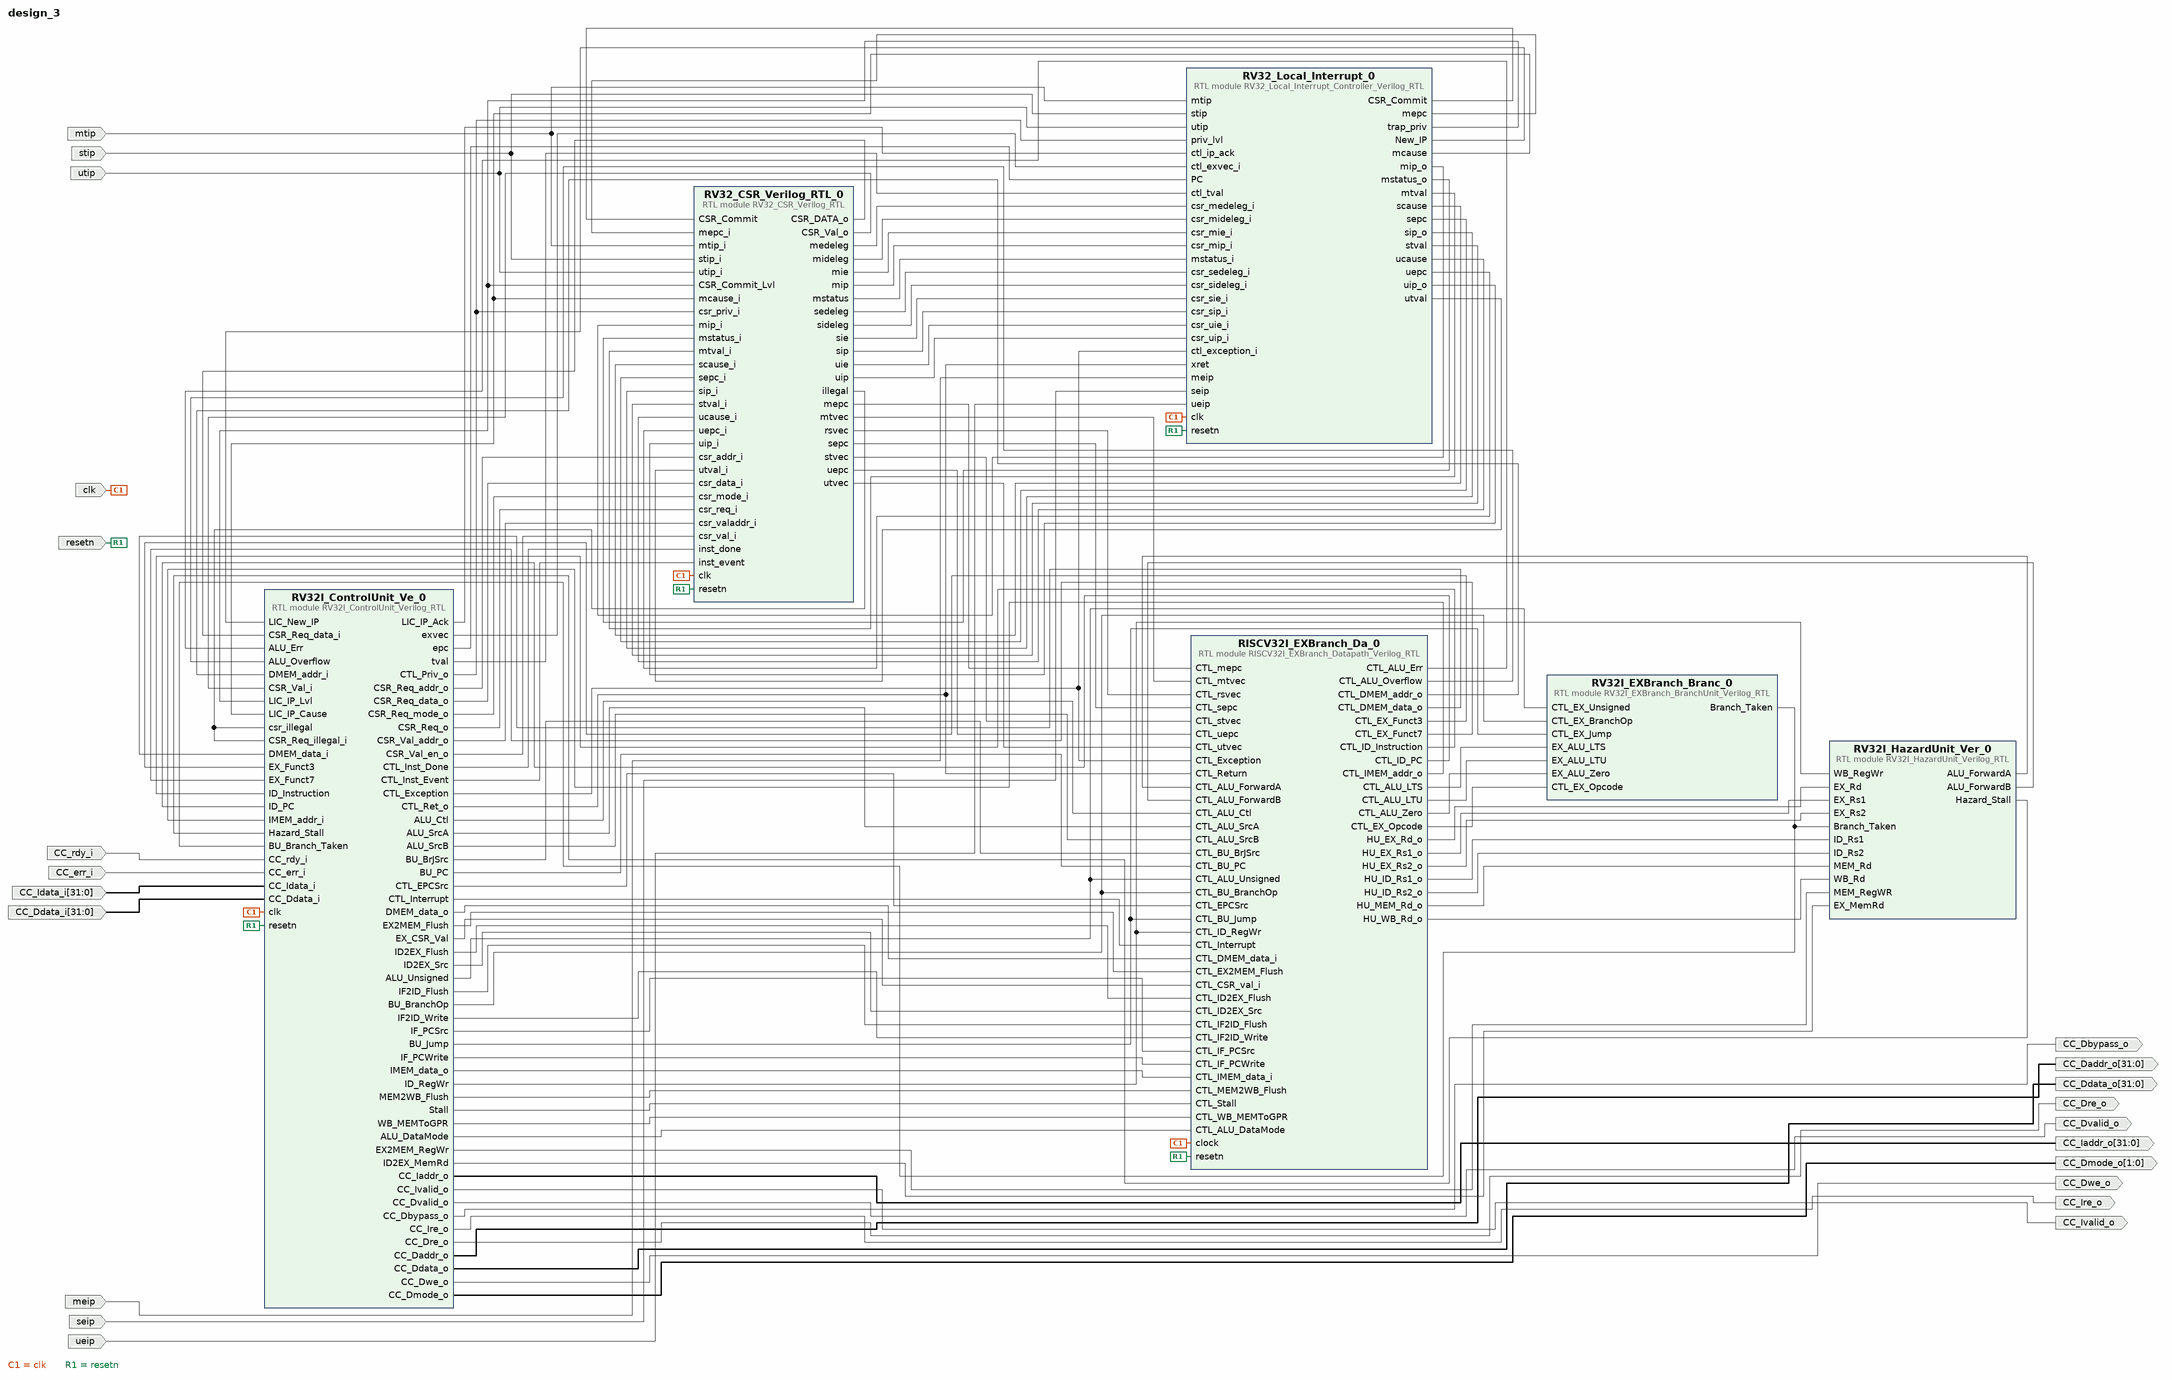
[diagram p0: block diagram of the top level]
# Vivado block design design_3, xc7z020clg484-1, Vivado 2019.2
create_bd_design design_3

create_bd_port -dir I meip
create_bd_port -dir I seip
create_bd_port -dir I ueip
create_bd_port -dir O CC_Ivalid_o
create_bd_port -dir O -from 31 -to 0 CC_Iaddr_o
create_bd_port -dir O CC_Ire_o
create_bd_port -dir O CC_Dvalid_o
create_bd_port -dir O CC_Dbypass_o
create_bd_port -dir O CC_Dre_o
create_bd_port -dir O CC_Dwe_o
create_bd_port -dir O -from 31 -to 0 CC_Daddr_o
create_bd_port -dir O -from 31 -to 0 CC_Ddata_o
create_bd_port -dir I CC_rdy_i
create_bd_port -dir I CC_err_i
create_bd_port -dir I -from 31 -to 0 CC_Idata_i
create_bd_port -dir I -from 31 -to 0 CC_Ddata_i
create_bd_port -dir I utip
create_bd_port -dir I stip
create_bd_port -dir I mtip
create_bd_port -dir I resetn
create_bd_port -dir I clk
create_bd_port -dir O -from 1 -to 0 CC_Dmode_o

create_bd_cell -type module -reference RV32I_EXBranch_BranchUnit_Verilog_RTL RV32I_EXBranch_Branc_0
create_bd_cell -type module -reference RV32I_HazardUnit_Verilog_RTL RV32I_HazardUnit_Ver_0
create_bd_cell -type module -reference RV32_Local_Interrupt_Controller_Verilog_RTL RV32_Local_Interrupt_0
create_bd_cell -type module -reference RV32_CSR_Verilog_RTL RV32_CSR_Verilog_RTL_0
create_bd_cell -type module -reference RV32I_ControlUnit_Verilog_RTL RV32I_ControlUnit_Ve_0
create_bd_cell -type module -reference RISCV32I_EXBranch_Datapath_Verilog_RTL RISCV32I_EXBranch_Da_0

# ---- connections ----

connect_bd_net [get_bd_pins RISCV32I_EXBranch_Da_0/CTL_ALU_Err] [get_bd_pins RV32I_ControlUnit_Ve_0/ALU_Err]
connect_bd_net [get_bd_pins RISCV32I_EXBranch_Da_0/CTL_ALU_LTS] [get_bd_pins RV32I_EXBranch_Branc_0/EX_ALU_LTS]
connect_bd_net [get_bd_pins RISCV32I_EXBranch_Da_0/CTL_ALU_LTU] [get_bd_pins RV32I_EXBranch_Branc_0/EX_ALU_LTU]
connect_bd_net [get_bd_pins RISCV32I_EXBranch_Da_0/CTL_ALU_Overflow] [get_bd_pins RV32I_ControlUnit_Ve_0/ALU_Overflow]
connect_bd_net [get_bd_pins RISCV32I_EXBranch_Da_0/CTL_ALU_Zero] [get_bd_pins RV32I_EXBranch_Branc_0/EX_ALU_Zero]
connect_bd_net [get_bd_pins RISCV32I_EXBranch_Da_0/CTL_DMEM_addr_o] [get_bd_pins RV32I_ControlUnit_Ve_0/DMEM_addr_i]
connect_bd_net [get_bd_pins RISCV32I_EXBranch_Da_0/CTL_DMEM_data_o] [get_bd_pins RV32I_ControlUnit_Ve_0/DMEM_data_i]
connect_bd_net [get_bd_pins RISCV32I_EXBranch_Da_0/CTL_EX_Funct3] [get_bd_pins RV32I_ControlUnit_Ve_0/EX_Funct3]
connect_bd_net [get_bd_pins RISCV32I_EXBranch_Da_0/CTL_EX_Funct7] [get_bd_pins RV32I_ControlUnit_Ve_0/EX_Funct7]
connect_bd_net [get_bd_pins RISCV32I_EXBranch_Da_0/CTL_EX_Opcode] [get_bd_pins RV32I_EXBranch_Branc_0/CTL_EX_Opcode]
connect_bd_net [get_bd_pins RISCV32I_EXBranch_Da_0/CTL_ID_Instruction] [get_bd_pins RV32I_ControlUnit_Ve_0/ID_Instruction]
connect_bd_net [get_bd_pins RISCV32I_EXBranch_Da_0/CTL_ID_PC] [get_bd_pins RV32I_ControlUnit_Ve_0/ID_PC]
connect_bd_net [get_bd_pins RISCV32I_EXBranch_Da_0/CTL_IMEM_addr_o] [get_bd_pins RV32I_ControlUnit_Ve_0/IMEM_addr_i]
connect_bd_net [get_bd_pins RISCV32I_EXBranch_Da_0/HU_EX_Rd_o] [get_bd_pins RV32I_HazardUnit_Ver_0/EX_Rd]
connect_bd_net [get_bd_pins RISCV32I_EXBranch_Da_0/HU_EX_Rs1_o] [get_bd_pins RV32I_HazardUnit_Ver_0/EX_Rs1]
connect_bd_net [get_bd_pins RISCV32I_EXBranch_Da_0/HU_EX_Rs2_o] [get_bd_pins RV32I_HazardUnit_Ver_0/EX_Rs2]
connect_bd_net [get_bd_pins RISCV32I_EXBranch_Da_0/HU_ID_Rs1_o] [get_bd_pins RV32I_HazardUnit_Ver_0/ID_Rs1]
connect_bd_net [get_bd_pins RISCV32I_EXBranch_Da_0/HU_ID_Rs2_o] [get_bd_pins RV32I_HazardUnit_Ver_0/ID_Rs2]
connect_bd_net [get_bd_pins RISCV32I_EXBranch_Da_0/HU_MEM_Rd_o] [get_bd_pins RV32I_HazardUnit_Ver_0/MEM_Rd]
connect_bd_net [get_bd_pins RV32I_ControlUnit_Ve_0/ALU_Ctl] [get_bd_pins RISCV32I_EXBranch_Da_0/CTL_ALU_Ctl]
connect_bd_net [get_bd_pins RV32I_ControlUnit_Ve_0/ALU_SrcA] [get_bd_pins RISCV32I_EXBranch_Da_0/CTL_ALU_SrcA]
connect_bd_net [get_bd_pins RV32I_ControlUnit_Ve_0/ALU_SrcB] [get_bd_pins RISCV32I_EXBranch_Da_0/CTL_ALU_SrcB]
connect_bd_net [get_bd_pins RV32I_ControlUnit_Ve_0/ALU_Unsigned] \
  [get_bd_pins RV32I_EXBranch_Branc_0/CTL_EX_Unsigned] [get_bd_pins RISCV32I_EXBranch_Da_0/CTL_ALU_Unsigned]
connect_bd_net [get_bd_pins RV32I_ControlUnit_Ve_0/BU_BrJSrc] [get_bd_pins RISCV32I_EXBranch_Da_0/CTL_BU_BrJSrc]
connect_bd_net [get_bd_pins RV32I_ControlUnit_Ve_0/BU_BranchOp] \
  [get_bd_pins RV32I_EXBranch_Branc_0/CTL_EX_BranchOp] [get_bd_pins RISCV32I_EXBranch_Da_0/CTL_BU_BranchOp]
connect_bd_net [get_bd_pins RV32I_ControlUnit_Ve_0/BU_Jump] \
  [get_bd_pins RV32I_EXBranch_Branc_0/CTL_EX_Jump] [get_bd_pins RISCV32I_EXBranch_Da_0/CTL_BU_Jump]
connect_bd_net [get_bd_pins RV32I_ControlUnit_Ve_0/BU_PC] [get_bd_pins RISCV32I_EXBranch_Da_0/CTL_BU_PC]
connect_bd_net [get_bd_pins RV32I_ControlUnit_Ve_0/CSR_Req_addr_o] [get_bd_pins RV32_CSR_Verilog_RTL_0/csr_addr_i]
connect_bd_net [get_bd_pins RV32I_ControlUnit_Ve_0/CSR_Req_data_o] [get_bd_pins RV32_CSR_Verilog_RTL_0/csr_data_i]
connect_bd_net [get_bd_pins RV32I_ControlUnit_Ve_0/CSR_Req_mode_o] [get_bd_pins RV32_CSR_Verilog_RTL_0/csr_mode_i]
connect_bd_net [get_bd_pins RV32I_ControlUnit_Ve_0/CSR_Req_o] [get_bd_pins RV32_CSR_Verilog_RTL_0/csr_req_i]
connect_bd_net [get_bd_pins RV32I_ControlUnit_Ve_0/CSR_Val_addr_o] [get_bd_pins RV32_CSR_Verilog_RTL_0/csr_valaddr_i]
connect_bd_net [get_bd_pins RV32I_ControlUnit_Ve_0/CSR_Val_en_o] [get_bd_pins RV32_CSR_Verilog_RTL_0/csr_val_i]
connect_bd_net [get_bd_pins RV32I_ControlUnit_Ve_0/CTL_EPCSrc] [get_bd_pins RISCV32I_EXBranch_Da_0/CTL_EPCSrc]
connect_bd_net [get_bd_pins RV32I_ControlUnit_Ve_0/CTL_Exception] \
  [get_bd_pins RV32_Local_Interrupt_0/ctl_exception_i] [get_bd_pins RISCV32I_EXBranch_Da_0/CTL_Exception]
connect_bd_net [get_bd_pins RV32I_ControlUnit_Ve_0/CTL_Inst_Done] [get_bd_pins RV32_CSR_Verilog_RTL_0/inst_done]
connect_bd_net [get_bd_pins RV32I_ControlUnit_Ve_0/CTL_Inst_Event] [get_bd_pins RV32_CSR_Verilog_RTL_0/inst_event]
connect_bd_net [get_bd_pins RV32I_ControlUnit_Ve_0/CTL_Interrupt] [get_bd_pins RISCV32I_EXBranch_Da_0/CTL_Interrupt]
connect_bd_net [get_bd_pins RV32I_ControlUnit_Ve_0/CTL_Priv_o] \
  [get_bd_pins RV32_Local_Interrupt_0/priv_lvl] [get_bd_pins RV32_CSR_Verilog_RTL_0/csr_priv_i]
connect_bd_net [get_bd_pins RV32I_ControlUnit_Ve_0/CTL_Ret_o] \
  [get_bd_pins RV32_Local_Interrupt_0/xret] [get_bd_pins RISCV32I_EXBranch_Da_0/CTL_Return]
connect_bd_net [get_bd_pins RV32I_ControlUnit_Ve_0/DMEM_data_o] [get_bd_pins RISCV32I_EXBranch_Da_0/CTL_DMEM_data_i]
connect_bd_net [get_bd_pins RV32I_ControlUnit_Ve_0/EX2MEM_Flush] [get_bd_pins RISCV32I_EXBranch_Da_0/CTL_EX2MEM_Flush]
connect_bd_net [get_bd_pins RV32I_ControlUnit_Ve_0/EX2MEM_RegWr] [get_bd_pins RV32I_HazardUnit_Ver_0/MEM_RegWR]
connect_bd_net [get_bd_pins RV32I_ControlUnit_Ve_0/EX_CSR_Val] [get_bd_pins RISCV32I_EXBranch_Da_0/CTL_CSR_val_i]
connect_bd_net [get_bd_pins RV32I_ControlUnit_Ve_0/ID2EX_Flush] [get_bd_pins RISCV32I_EXBranch_Da_0/CTL_ID2EX_Flush]
connect_bd_net [get_bd_pins RV32I_ControlUnit_Ve_0/ID2EX_MemRd] [get_bd_pins RV32I_HazardUnit_Ver_0/EX_MemRd]
connect_bd_net [get_bd_pins RV32I_ControlUnit_Ve_0/ID2EX_Src] [get_bd_pins RISCV32I_EXBranch_Da_0/CTL_ID2EX_Src]
connect_bd_net [get_bd_pins RV32I_ControlUnit_Ve_0/ID_RegWr] \
  [get_bd_pins RV32I_HazardUnit_Ver_0/WB_RegWr] [get_bd_pins RISCV32I_EXBranch_Da_0/CTL_ID_RegWr]
connect_bd_net [get_bd_pins RV32I_ControlUnit_Ve_0/IF2ID_Flush] [get_bd_pins RISCV32I_EXBranch_Da_0/CTL_IF2ID_Flush]
connect_bd_net [get_bd_pins RV32I_ControlUnit_Ve_0/IF2ID_Write] [get_bd_pins RISCV32I_EXBranch_Da_0/CTL_IF2ID_Write]
connect_bd_net [get_bd_pins RV32I_ControlUnit_Ve_0/IF_PCSrc] [get_bd_pins RISCV32I_EXBranch_Da_0/CTL_IF_PCSrc]
connect_bd_net [get_bd_pins RV32I_ControlUnit_Ve_0/IF_PCWrite] [get_bd_pins RISCV32I_EXBranch_Da_0/CTL_IF_PCWrite]
connect_bd_net [get_bd_pins RV32I_ControlUnit_Ve_0/IMEM_data_o] [get_bd_pins RISCV32I_EXBranch_Da_0/CTL_IMEM_data_i]
connect_bd_net [get_bd_pins RV32I_ControlUnit_Ve_0/LIC_IP_Ack] [get_bd_pins RV32_Local_Interrupt_0/ctl_ip_ack]
connect_bd_net [get_bd_pins RV32I_ControlUnit_Ve_0/MEM2WB_Flush] [get_bd_pins RISCV32I_EXBranch_Da_0/CTL_MEM2WB_Flush]
connect_bd_net [get_bd_pins RV32I_ControlUnit_Ve_0/Stall] [get_bd_pins RISCV32I_EXBranch_Da_0/CTL_Stall]
connect_bd_net [get_bd_pins RV32I_ControlUnit_Ve_0/WB_MEMToGPR] [get_bd_pins RISCV32I_EXBranch_Da_0/CTL_WB_MEMToGPR]
connect_bd_net -net RV32I_ControlUnit_Ve_0_ecausevec [get_bd_pins RV32I_ControlUnit_Ve_0/exvec] [get_bd_pins RV32_Local_Interrupt_0/ctl_exvec_i]
connect_bd_net [get_bd_pins RV32I_ControlUnit_Ve_0/epc] [get_bd_pins RV32_Local_Interrupt_0/PC]
connect_bd_net [get_bd_pins RV32I_ControlUnit_Ve_0/tval] [get_bd_pins RV32_Local_Interrupt_0/ctl_tval]
connect_bd_net [get_bd_pins RV32I_HazardUnit_Ver_0/ALU_ForwardA] [get_bd_pins RISCV32I_EXBranch_Da_0/CTL_ALU_ForwardA]
connect_bd_net [get_bd_pins RV32I_HazardUnit_Ver_0/ALU_ForwardB] [get_bd_pins RISCV32I_EXBranch_Da_0/CTL_ALU_ForwardB]
connect_bd_net [get_bd_pins RV32I_HazardUnit_Ver_0/Hazard_Stall] [get_bd_pins RV32I_ControlUnit_Ve_0/Hazard_Stall]
connect_bd_net -net RV32I_IDBranch_Branc_0_Branch_Taken [get_bd_pins RV32I_EXBranch_Branc_0/Branch_Taken] \
  [get_bd_pins RV32I_HazardUnit_Ver_0/Branch_Taken] [get_bd_pins RV32I_ControlUnit_Ve_0/BU_Branch_Taken]
connect_bd_net -net RV32_AXI_Timer_Count_0_mtip [get_bd_ports mtip] \
  [get_bd_pins RV32_Local_Interrupt_0/mtip] [get_bd_pins RV32_CSR_Verilog_RTL_0/mtip_i]
connect_bd_net -net RV32_AXI_Timer_Count_0_stip [get_bd_ports stip] \
  [get_bd_pins RV32_Local_Interrupt_0/stip] [get_bd_pins RV32_CSR_Verilog_RTL_0/stip_i]
connect_bd_net -net RV32_AXI_Timer_Count_0_utip [get_bd_ports utip] \
  [get_bd_pins RV32_Local_Interrupt_0/utip] [get_bd_pins RV32_CSR_Verilog_RTL_0/utip_i]
connect_bd_net [get_bd_pins RV32_CSR_Verilog_RTL_0/CSR_DATA_o] [get_bd_pins RV32I_ControlUnit_Ve_0/CSR_Req_data_i]
connect_bd_net [get_bd_pins RV32_CSR_Verilog_RTL_0/CSR_Val_o] [get_bd_pins RV32I_ControlUnit_Ve_0/CSR_Val_i]
connect_bd_net [get_bd_pins RV32_CSR_Verilog_RTL_0/illegal] \
  [get_bd_pins RV32I_ControlUnit_Ve_0/CSR_Req_illegal_i] [get_bd_pins RV32I_ControlUnit_Ve_0/csr_illegal]
connect_bd_net [get_bd_pins RV32_CSR_Verilog_RTL_0/medeleg] [get_bd_pins RV32_Local_Interrupt_0/csr_medeleg_i]
connect_bd_net [get_bd_pins RV32_CSR_Verilog_RTL_0/mepc] [get_bd_pins RISCV32I_EXBranch_Da_0/CTL_mepc]
connect_bd_net [get_bd_pins RV32_CSR_Verilog_RTL_0/mideleg] [get_bd_pins RV32_Local_Interrupt_0/csr_mideleg_i]
connect_bd_net [get_bd_pins RV32_CSR_Verilog_RTL_0/mie] [get_bd_pins RV32_Local_Interrupt_0/csr_mie_i]
connect_bd_net [get_bd_pins RV32_CSR_Verilog_RTL_0/mip] [get_bd_pins RV32_Local_Interrupt_0/csr_mip_i]
connect_bd_net [get_bd_pins RV32_CSR_Verilog_RTL_0/mstatus] [get_bd_pins RV32_Local_Interrupt_0/mstatus_i]
connect_bd_net [get_bd_pins RV32_CSR_Verilog_RTL_0/mtvec] [get_bd_pins RISCV32I_EXBranch_Da_0/CTL_mtvec]
connect_bd_net [get_bd_pins RV32_CSR_Verilog_RTL_0/rsvec] [get_bd_pins RISCV32I_EXBranch_Da_0/CTL_rsvec]
connect_bd_net [get_bd_pins RV32_CSR_Verilog_RTL_0/sedeleg] [get_bd_pins RV32_Local_Interrupt_0/csr_sedeleg_i]
connect_bd_net [get_bd_pins RV32_CSR_Verilog_RTL_0/sepc] [get_bd_pins RISCV32I_EXBranch_Da_0/CTL_sepc]
connect_bd_net [get_bd_pins RV32_CSR_Verilog_RTL_0/sideleg] [get_bd_pins RV32_Local_Interrupt_0/csr_sideleg_i]
connect_bd_net [get_bd_pins RV32_CSR_Verilog_RTL_0/sie] [get_bd_pins RV32_Local_Interrupt_0/csr_sie_i]
connect_bd_net [get_bd_pins RV32_CSR_Verilog_RTL_0/sip] [get_bd_pins RV32_Local_Interrupt_0/csr_sip_i]
connect_bd_net [get_bd_pins RV32_CSR_Verilog_RTL_0/stvec] [get_bd_pins RISCV32I_EXBranch_Da_0/CTL_stvec]
connect_bd_net [get_bd_pins RV32_CSR_Verilog_RTL_0/uepc] [get_bd_pins RISCV32I_EXBranch_Da_0/CTL_uepc]
connect_bd_net [get_bd_pins RV32_CSR_Verilog_RTL_0/uie] [get_bd_pins RV32_Local_Interrupt_0/csr_uie_i]
connect_bd_net [get_bd_pins RV32_CSR_Verilog_RTL_0/uip] [get_bd_pins RV32_Local_Interrupt_0/csr_uip_i]
connect_bd_net [get_bd_pins RV32_CSR_Verilog_RTL_0/utvec] [get_bd_pins RISCV32I_EXBranch_Da_0/CTL_utvec]
connect_bd_net [get_bd_pins RV32_Local_Interrupt_0/CSR_Commit] [get_bd_pins RV32_CSR_Verilog_RTL_0/CSR_Commit]
connect_bd_net -net RV32_Local_Interrupt_0_CSR_Commit_Lvl [get_bd_pins RV32_Local_Interrupt_0/trap_priv] \
  [get_bd_pins RV32_CSR_Verilog_RTL_0/CSR_Commit_Lvl] [get_bd_pins RV32I_ControlUnit_Ve_0/LIC_IP_Lvl]
connect_bd_net [get_bd_pins RV32_Local_Interrupt_0/New_IP] [get_bd_pins RV32I_ControlUnit_Ve_0/LIC_New_IP]
connect_bd_net [get_bd_pins RV32_Local_Interrupt_0/mcause] \
  [get_bd_pins RV32_CSR_Verilog_RTL_0/mcause_i] [get_bd_pins RV32I_ControlUnit_Ve_0/LIC_IP_Cause]
connect_bd_net [get_bd_pins RV32_Local_Interrupt_0/mepc] [get_bd_pins RV32_CSR_Verilog_RTL_0/mepc_i]
connect_bd_net [get_bd_pins RV32_Local_Interrupt_0/mip_o] [get_bd_pins RV32_CSR_Verilog_RTL_0/mip_i]
connect_bd_net [get_bd_pins RV32_Local_Interrupt_0/mstatus_o] [get_bd_pins RV32_CSR_Verilog_RTL_0/mstatus_i]
connect_bd_net [get_bd_pins RV32_Local_Interrupt_0/mtval] [get_bd_pins RV32_CSR_Verilog_RTL_0/mtval_i]
connect_bd_net [get_bd_pins RV32_Local_Interrupt_0/scause] [get_bd_pins RV32_CSR_Verilog_RTL_0/scause_i]
connect_bd_net [get_bd_pins RV32_Local_Interrupt_0/sepc] [get_bd_pins RV32_CSR_Verilog_RTL_0/sepc_i]
connect_bd_net [get_bd_pins RV32_Local_Interrupt_0/sip_o] [get_bd_pins RV32_CSR_Verilog_RTL_0/sip_i]
connect_bd_net [get_bd_pins RV32_Local_Interrupt_0/stval] [get_bd_pins RV32_CSR_Verilog_RTL_0/stval_i]
connect_bd_net [get_bd_pins RV32_Local_Interrupt_0/ucause] [get_bd_pins RV32_CSR_Verilog_RTL_0/ucause_i]
connect_bd_net [get_bd_pins RV32_Local_Interrupt_0/uepc] [get_bd_pins RV32_CSR_Verilog_RTL_0/uepc_i]
connect_bd_net [get_bd_pins RV32_Local_Interrupt_0/uip_o] [get_bd_pins RV32_CSR_Verilog_RTL_0/uip_i]
connect_bd_net [get_bd_pins RV32_Local_Interrupt_0/utval] [get_bd_pins RV32_CSR_Verilog_RTL_0/utval_i]
connect_bd_net [get_bd_ports meip] [get_bd_pins RV32_Local_Interrupt_0/meip]
connect_bd_net -net processing_system7_0_FCLK_CLK0 [get_bd_ports clk] \
  [get_bd_pins RV32_Local_Interrupt_0/clk] [get_bd_pins RV32_CSR_Verilog_RTL_0/clk] [get_bd_pins RV32I_ControlUnit_Ve_0/clk] \
  [get_bd_pins RISCV32I_EXBranch_Da_0/clock]
connect_bd_net -net rst_ps7_0_100M_peripheral_aresetn [get_bd_ports resetn] \
  [get_bd_pins RV32_Local_Interrupt_0/resetn] [get_bd_pins RV32_CSR_Verilog_RTL_0/resetn] \
  [get_bd_pins RV32I_ControlUnit_Ve_0/resetn] [get_bd_pins RISCV32I_EXBranch_Da_0/resetn]
connect_bd_net [get_bd_ports seip] [get_bd_pins RV32_Local_Interrupt_0/seip]
connect_bd_net [get_bd_ports ueip] [get_bd_pins RV32_Local_Interrupt_0/ueip]
connect_bd_net [get_bd_pins RV32I_ControlUnit_Ve_0/CC_Ivalid_o] [get_bd_ports CC_Ivalid_o]
connect_bd_net [get_bd_pins RV32I_ControlUnit_Ve_0/CC_Iaddr_o] [get_bd_ports CC_Iaddr_o]
connect_bd_net [get_bd_pins RV32I_ControlUnit_Ve_0/CC_Ire_o] [get_bd_ports CC_Ire_o]
connect_bd_net [get_bd_pins RV32I_ControlUnit_Ve_0/CC_Dvalid_o] [get_bd_ports CC_Dvalid_o]
connect_bd_net [get_bd_pins RV32I_ControlUnit_Ve_0/CC_Dbypass_o] [get_bd_ports CC_Dbypass_o]
connect_bd_net [get_bd_pins RV32I_ControlUnit_Ve_0/CC_Dre_o] [get_bd_ports CC_Dre_o]
connect_bd_net [get_bd_pins RV32I_ControlUnit_Ve_0/CC_Dwe_o] [get_bd_ports CC_Dwe_o]
connect_bd_net [get_bd_pins RV32I_ControlUnit_Ve_0/CC_Daddr_o] [get_bd_ports CC_Daddr_o]
connect_bd_net [get_bd_pins RV32I_ControlUnit_Ve_0/CC_Ddata_o] [get_bd_ports CC_Ddata_o]
connect_bd_net [get_bd_ports CC_rdy_i] [get_bd_pins RV32I_ControlUnit_Ve_0/CC_rdy_i]
connect_bd_net [get_bd_ports CC_err_i] [get_bd_pins RV32I_ControlUnit_Ve_0/CC_err_i]
connect_bd_net [get_bd_ports CC_Idata_i] [get_bd_pins RV32I_ControlUnit_Ve_0/CC_Idata_i]
connect_bd_net [get_bd_ports CC_Ddata_i] [get_bd_pins RV32I_ControlUnit_Ve_0/CC_Ddata_i]
connect_bd_net [get_bd_pins RV32I_ControlUnit_Ve_0/ALU_DataMode] [get_bd_pins RISCV32I_EXBranch_Da_0/CTL_ALU_DataMode]
connect_bd_net [get_bd_pins RISCV32I_EXBranch_Da_0/HU_WB_Rd_o] [get_bd_pins RV32I_HazardUnit_Ver_0/WB_Rd]
connect_bd_net [get_bd_pins RV32I_ControlUnit_Ve_0/CC_Dmode_o] [get_bd_ports CC_Dmode_o]

validate_bd_design
save_bd_design
